# Altium schematic sheet Sheet1.SchDoc
size A; SheetNumber: 1; SheetTotal: 1
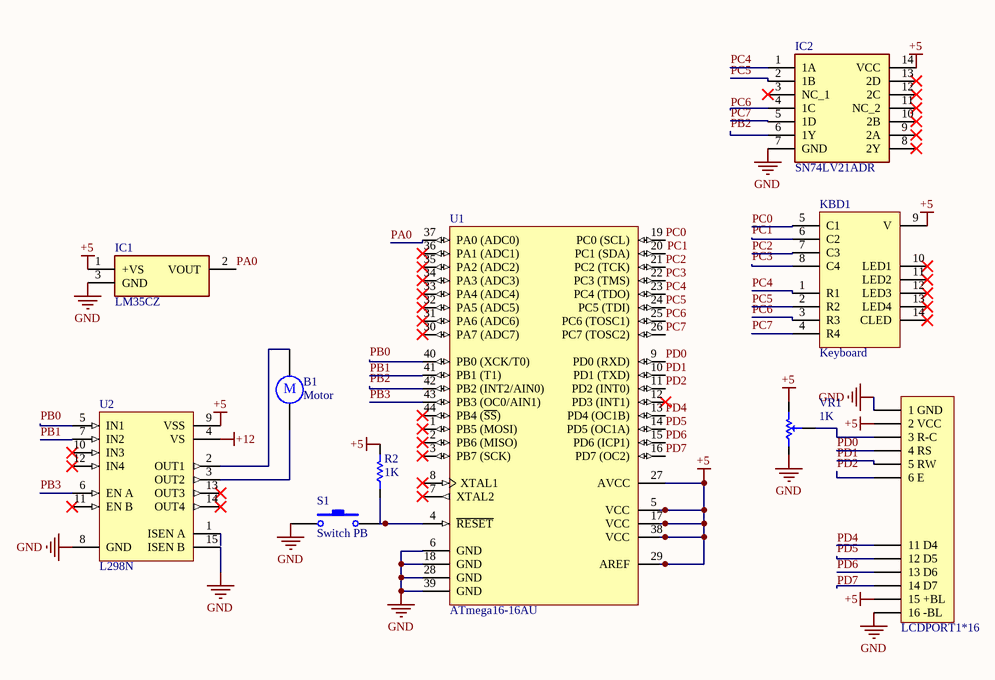
[diagram p0: Sheet1.SchDoc]

## Parts
B1  Motor  [RB5-10.5]
IC1  LM35CZ  [TO127P254X495-3P]
IC2  SN74LV21ADR  [SOIC127P600X175-14N]
KBD1  Keyboard  [Keyboard]
LCDPORT1*16  LCDPORT1*16  [HDR1X16]  (value not drawn)
R2  1K  [RES 0805 (2012X06L)]
S1  Switch PB  [Switch - Push to On]
U1  ATmega16-16AU  [44A_N]
U2  L298N  [Multiwatt15H]
VR1  1K  [Pot 00]

## Nets
+5: IC1.1(+VS) IC2.14(VCC) KBD1.9(V) LCDPORT1*16.2(2_VCC) LCDPORT1*16.15(15_+BL) R2.2 U1.5(VCC) U1.17(VCC) U1.27(AVCC) U1.29(AREF) U1.38(VCC) U2.9(VSS) VR1.2(CW)
+12: U2.4(VS)
GND: IC1.3(GND) IC2.7(GND) LCDPORT1*16.1(1_GND) LCDPORT1*16.16(16_-BL) S1.1 U1.6(GND) U1.18(GND) U1.28(GND) U1.39(GND) U2.8(GND) U2.15(ISEN_B) VR1.1(CCW)
PA0: IC1.2(VOUT) U1.37(PA0_(ADC0))
PB0: U1.40(PB0_(XCK/T0)) U2.5(IN1)
PB1: U2.7(IN2)
PB2: IC2.6(1Y) U1.42(PB2_(INT2/AIN0))
PB3: U1.43(PB3_(OC0/AIN1)) U2.6(EN_A)
PC0: KBD1.5(C1) U1.19(PC0_(SCL))
PC1: KBD1.6(C2)
PC2: KBD1.7(C3) U1.21(PC2_(TCK))
PC3: KBD1.8(C4) U1.22(PC3_(TMS))
PC4: IC2.1(1A) KBD1.1(R1) U1.23(PC4_(TDO))
PC5: IC2.2(1B) KBD1.2(R2) U1.24(PC5_(TDI))
PC6: IC2.4(1C) KBD1.3(R3) U1.25(PC6_(TOSC1))
PC7: IC2.5(1D) KBD1.4(R4) U1.26(PC7_(TOSC2))
PD0: LCDPORT1*16.4(4_RS) U1.9(PD0_(RXD))
PD1: LCDPORT1*16.5(5_RW) U1.10(PD1_(TXD))
PD2: LCDPORT1*16.6(6_E) U1.11(PD2_(INT0))
PD4: LCDPORT1*16.11(11_D4) U1.13(PD4_(OC1B))
PD5: LCDPORT1*16.12(12_D5) U1.14(PD5_(OC1A))
PD6: LCDPORT1*16.13(13_D6) U1.15(PD6_(ICP1))
PD7: LCDPORT1*16.14(14_D7) U1.16(PD7_(OC2))
NetB1_1: B1.1 U2.2(OUT1)
NetB1_2: B1.2 U2.3(OUT2)
NetLCDPORT1*16_3: LCDPORT1*16.3(3_R-C) VR1.3(Setpoint)
NetR2_1: R2.1 S1.2 U1.4(~{RESET})

Not connected (* = marked no-connect by the designer): IC2 3(NC_1)* 8(2Y)* 9(2A)* 10(2B)* 11(NC_2)* 12(2C)* 13(2D)*; KBD1 10(LED1)* 11(LED2)* 12(LED3)* 13(LED4)* 14(CLED)*; U1 1(PB5_(MOSI))* 2(PB6_(MISO))* 3(PB7_(SCK))* 7(XTAL2)* 8(XTAL1)* 12(PD3_(INT1))* 20(PC1_(SDA)) 30(PA7_(ADC7))* 31(PA6_(ADC6))* 32(PA5_(ADC5))* 33(PA4_(ADC4))* 34(PA3_(ADC3))* 35(PA2_(ADC2))* 36(PA1_(ADC1))* 41(PB1_(T1)) 44(PB4_(~{SS}))*; U2 1(ISEN_A) 10(IN3)* 11(EN_B)* 12(IN4)* 13(OUT3)* 14(OUT4)*

## Notes on the sheet
- Labels drawn without touching a wire or pin: PC1
- (in symbol Motor) M

## Library data of the parts
B1 = Motor: Motor, General Kind; Published: 24-Mar-1999; LatestRevisionDate: 17-Jul-2002; LatestRevisionNote: Re-released for DXP Platform.; PackageReference: RB5-10.5; Publisher: Altium Limited; PackageDescription: Capacitor (Radial); 2 Leads
IC1 = LM35CZ: Integrated Circuit; Manufacturer_Name: Texas Instruments; Manufacturer_Part_Number: LM35CZ; Mouser Part Number: 926-LM35CZ; Mouser Price/Stock: https://www.mouser.co.uk/ProductDetail/Texas-Instruments/LM35CZ?qs=QbsRYf82W3GOOtuH6W%2F42g%3D%3D
IC2 = SN74LV21ADR: Integrated Circuit; Manufacturer_Name: Texas Instruments; Datasheet Link: http://www.ti.com/lit/gpn/sn74lv21a; Height: 1.75mm; Manufacturer_Part_Number: SN74LV21ADR; Mouser Part Number: 595-SN74LV21ADR; Mouser Price/Stock: https://www.mouser.co.uk/ProductDetail/Texas-Instruments/SN74LV21ADR?qs=q81XD9WTF%252BKhk1xwG%2Fa4dw%3D%3D
KBD1 = Keyboard Matrix 4x4: Designer: Saeid Jorablo; Company: Personal; Project Name: Abtahi; Adding Date: 10/21/2009
LCDPORT1*16 = LCDPORT 1*16: LCDPORT 1*16; 80mm*36mm; Designer: Seyed Mohsen Ghasemain; ComponentLinkURL: www.picpars.com
R2 = Resistor: Tolerance: 5%; Value: 1K
S1 = Switch PB: Push Button Switch
U1 = ATmega16-16AU: 8-bit AVR Microcontroller, 4.5-5.5V, 16KB Flash, 512 Bytes EEPROM, 1KB SRAM, 44-pin TQFP, Industrial Grade (-40°C to 85°C), Pb-Free; DatasheetVersion: revT, Jul-2010; PackageVersion: revC, Oct-2010; PackageReference: 44A; PackageDescription: 44-Pin Plastic Thin Profile Quad Flat Pack, 10 x 10 x 1.0 mm Body, 0.8 mm Pitch (TQFP); Code_JEDEC: MS-026-ACB; ComponentLink1Description: Manufacturer URL; ComponentLink1URL: http://www.atmel.com/; ComponentLink2Description: ATmega16(L)  Datasheet; ComponentLink2URL: http://www.atmel.com/dyn/resources/prod_documents/doc2466.pdf; ComponentLink3Description: ATmega16(L) Summary; ComponentLink3URL: http://www.atmel.com/dyn/resources/prod_documents/2466S.pdf
U2 = L298N: Dual Full Bridge Driver; Revision 1: 24-Aug-2001: Footprint Added.; Revision 2: 17-Jul-2002: Re-released for DXP Platform.; Package Information: Latest Revision: Apr-1998; Published: 8-Jun-2000; Datasheet: Latest Revision: Jul-1999; Package Reference: Multiwatt15H; Publisher: Altium Limited
VR1 = Resistor Variable: Variable Resistor; Designer: Saeid Jorablo; Company: ControTec; Adding Date: 137/12/22; Value: 1K